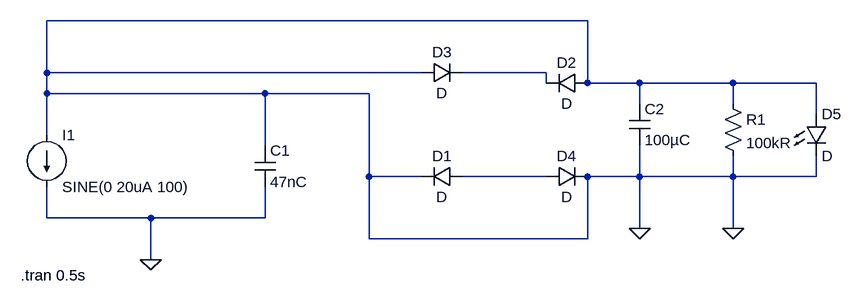
[diagram p0: schematic piezo_teng_harvester.asc]
piezo_teng_harvester.asc, the LTspice schematic file:
Version 4.1
SHEET 1 1292 680
WIRE 880 -64 48 -64
WIRE 48 16 48 -64
WIRE 624 16 48 16
WIRE 816 16 688 16
WIRE 816 32 816 16
WIRE 880 32 880 -64
WIRE 960 32 880 32
WIRE 1104 32 960 32
WIRE 1232 32 1104 32
WIRE 48 48 48 16
WIRE 384 48 48 48
WIRE 544 48 384 48
WIRE 960 64 960 32
WIRE 1104 64 1104 32
WIRE 1232 80 1232 32
WIRE 48 112 48 48
WIRE 384 128 384 48
WIRE 544 176 544 48
WIRE 624 176 544 176
WIRE 816 176 688 176
WIRE 960 176 960 128
WIRE 960 176 880 176
WIRE 1104 176 1104 144
WIRE 1104 176 960 176
WIRE 1232 176 1232 144
WIRE 1232 176 1104 176
WIRE 48 240 48 192
WIRE 208 240 48 240
WIRE 384 240 384 192
WIRE 384 240 208 240
WIRE 960 256 960 176
WIRE 1104 256 1104 176
WIRE 544 272 544 176
WIRE 880 272 880 176
WIRE 880 272 544 272
WIRE 208 304 208 240
FLAG 208 304 0
FLAG 960 256 0
FLAG 1104 256 0
SYMBOL current 48 112 R0
WINDOW 123 0 0 Left 0
WINDOW 39 0 0 Left 0
SYMATTR InstName I1
SYMATTR Value SINE(0 20uA 100)
SYMBOL cap 368 128 R0
SYMATTR InstName C1
SYMATTR Value 47nC
SYMBOL diode 688 160 R90
WINDOW 0 0 32 VBottom 2
WINDOW 3 32 32 VTop 2
SYMATTR InstName D1
SYMBOL diode 880 16 R90
WINDOW 0 0 32 VBottom 2
WINDOW 3 32 32 VTop 2
SYMATTR InstName D2
SYMBOL diode 624 32 R270
WINDOW 0 32 32 VTop 2
WINDOW 3 0 32 VBottom 2
SYMATTR InstName D3
SYMBOL diode 816 192 R270
WINDOW 0 32 32 VTop 2
WINDOW 3 0 32 VBottom 2
SYMATTR InstName D4
SYMBOL cap 944 64 R0
SYMATTR InstName C2
SYMATTR Value 100µC
SYMBOL res 1088 48 R0
SYMATTR InstName R1
SYMATTR Value 100kR
SYMBOL LED 1216 80 R0
SYMATTR InstName D5
TEXT 8 328 Left 2 !.tran 0.5s

The netlist it stands for:
* piezo_teng_harvester.asc
I1 0 0 SINE(0 20uA 100)
C1 0 0 47nC
D1 N002 0 D
D2 0 N001 D
D3 0 N001 D
D4 N002 0 D
C2 0 0 100µC
R1 0 0 100kR
D5 0 0 D
.model D D
.lib standard.dio
.tran 0.5s
.backanno
.end